# Altium schematic sheet Sheet_3.schdoc
size 300 x 214 mm
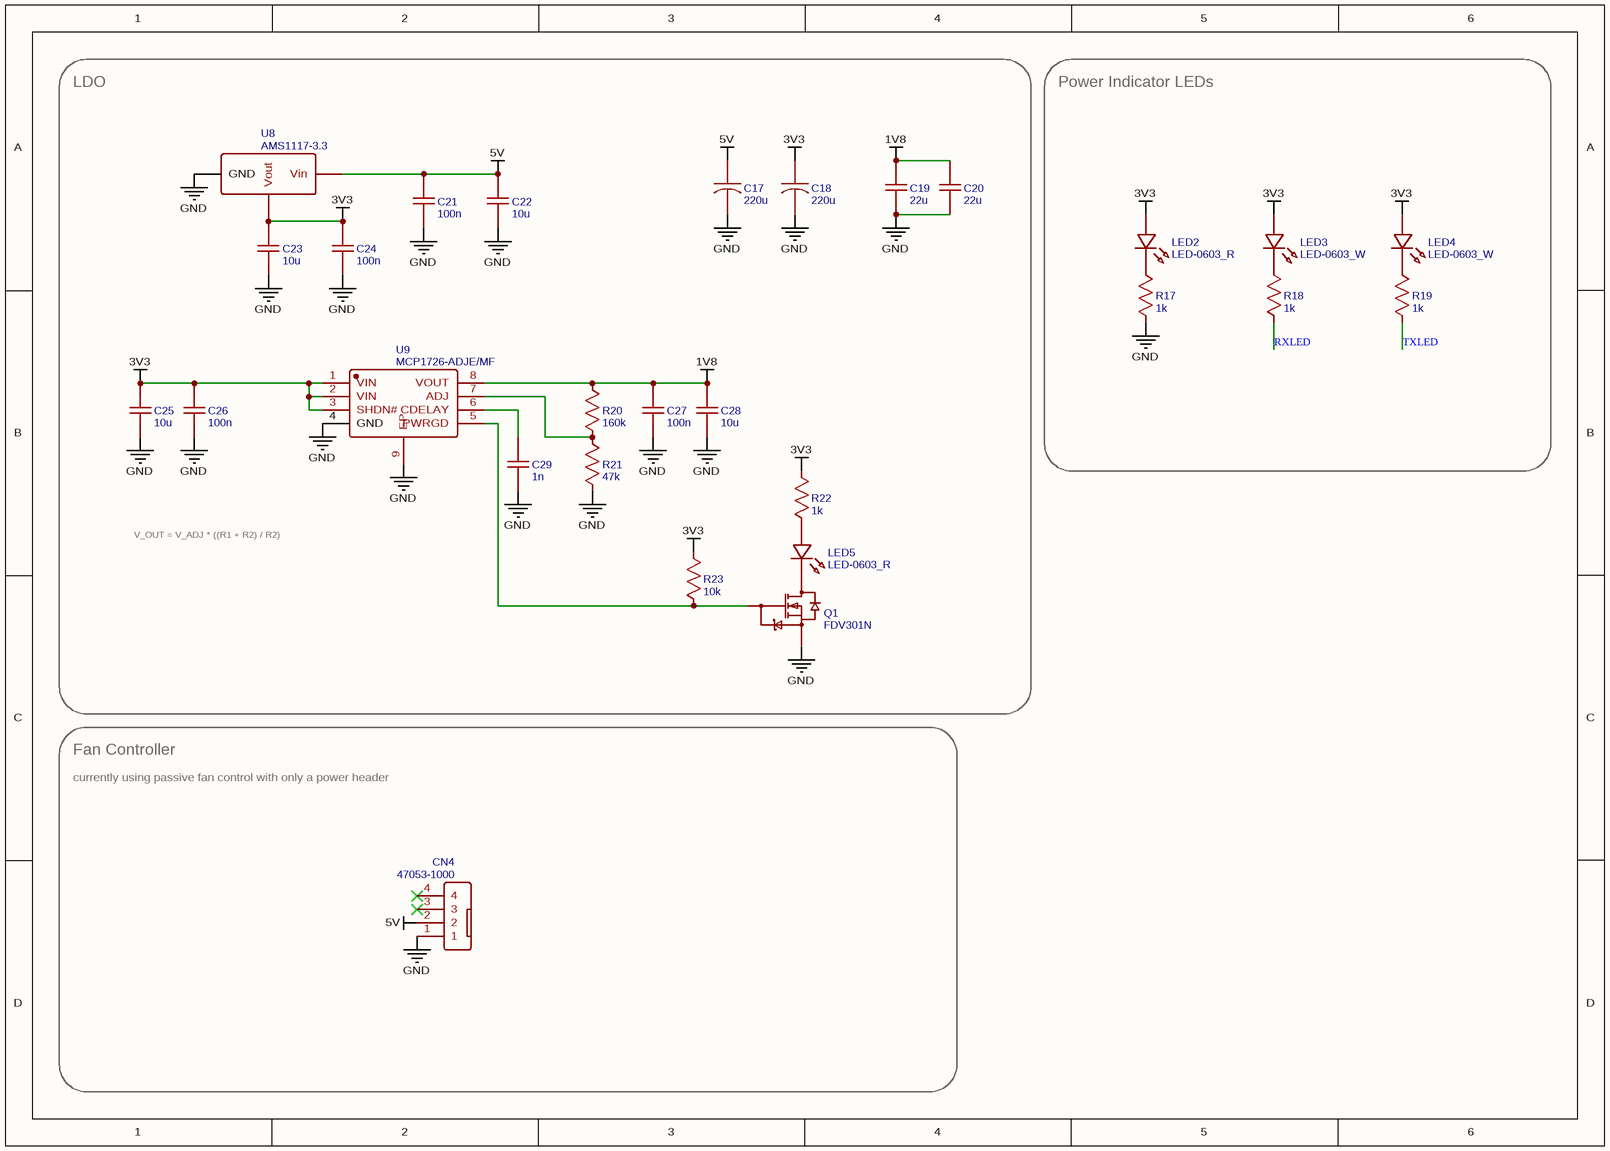
[diagram p0: Sheet_3.schdoc]

## Parts
C17  220u  [CAPPR5.0-D6.3_L6.6_W6.6]
C18  220u  [CAPPR5.0-D6.3_L6.6_W6.6]
C19  22u  [CAPA-1206]
C20  22u  [CAPA-1206]
C21  100n  [CAPA-0402]
C22  10u  [CAPA-0402]
C23  10u  [CAPA-0402]
C24  100n  [CAPA-0402]
C25  10u  [CAPA-0402]
C26  100n  [CAPA-0402]
C27  100n  [CAPA-0402]
C28  10u  [CAPA-0402]
C29  1n  [CAPA-0402]
CN4  47053-1000  [CONN-TH_47053-1000]
LED2  LED-0603_R  [LED-0603]
LED3  LED-0603_W  [LED-0603]
LED4  LED-0603_W  [LED-0603]
LED5  LED-0603_R  [LED-0603]
Q1  FDV301N  [SOT-23_L2.9-W1.3-P1.90-LS2.4-BR]
R17  1k  [RES-0402]
R18  1k  [RES-0402]
R19  1k  [RES-0402]
R20  160k  [RES-0402]
R21  47k  [RES-0402]
R22  1k  [RES-0402]
R23  10k  [RES-0402]
U8  AMS1117-3.3  [SOT-223_L6.5_W3.5_P2.30_BL]
U9  MCP1726-ADJE/MF  [TDFN-8_L3.0-W3.0-P0.65-BL-EP]

## Blocks framed on the sheet
LDO: C17-C29 LED5 Q1 R20-R23 U8 U9
Power Indicator LEDs: LED2-LED4 R17-R19
Fan Controller: CN4

## Nets
1V8: C19.2 C20.2 C27.2 C28.2 R20.2 U9.8(VOUT)
3V3: C18.1 C23.2 C24.2 C25.2 C26.2 LED2.1 LED3.1 LED4.1 R22.2 R23.2 U8.2(Vout) U9.1(VIN) U9.2(VIN) U9.3(SHDN#)
5V: C17.1 C21.2 C22.2 CN4.2 U8.3(Vin)
GND: C17.2 C18.2 C19.1 C20.1 C21.1 C22.1 C23.1 C24.1 C25.1 C26.1 C27.1 C28.1 C29.1 CN4.1 Q1.2(S) R17.1 R21.1 U8.1(GND) U9.4(GND) U9.9(EP)
RXLED: R18.1
TXLED: R19.1
NetC29_2: C29.2 U9.6(CDELAY)
NetLED2_2: LED2.2 R17.2
NetLED3_2: LED3.2 R18.2
NetLED4_2: LED4.2 R19.2
NetLED5_1: LED5.1 R22.1
NetLED5_2: LED5.2 Q1.3(D)
NetQ1_1: Q1.1(G) R23.1 U9.5(PWRGD)
NetR20_1: R20.1 R21.2 U9.7(ADJ)

Not connected (* = marked no-connect by the designer): CN4 3* 4*

## Notes on the sheet
- V_OUT = V_ADJ * ((R1 + R2) / R2)
- currently using passive fan control with only a power header

## Library data of the parts
C17 C18 = 220u: BOM_Manufacturer Part: CK1A221M-CRE54; BOM_Manufacturer: SEMTECH 先科; nameAlias: Value(F); BOM_Supplier Part: C131157; BOM_Supplier: LCSC; link: https://atta.szlcsc.com//upload/public/pdf/source/20170919/C131157_1505787258263977000.pdf; spicePre: C; spiceSymbolName: CAPPR5.0-D6.3_220u_10V
C19 C20 = 22u: BOM_Manufacturer Part: CL31A226KAHNNNE; BOM_Manufacturer: SAMSUNG; nameAlias: Value(F); BOM_Supplier Part: C12891; BOM_Supplier: LCSC; link: https://atta.szlcsc.com/upload/public/pdf/source/20170325/1490427913016.pdf; spicePre: C; spiceSymbolName: CAPA-1206_22u_25V
C21 C24 C26 C27 = 100n: BOM_Manufacturer Part: CL05B104KB54PNC; BOM_Manufacturer: SAMSUNG; nameAlias: Value(F); BOM_Supplier Part: C307331; BOM_Supplier: LCSC; link: https://atta.szlcsc.com//upload/public/pdf/source/20160103/1457707735223.pdf; spicePre: C; spiceSymbolName: CAPA-0402_100n
C22 C23 C25 C28 = 10u: BOM_Manufacturer Part: JMK105CBJ106MV-F; BOM_Manufacturer: TAIYO YUDEN; nameAlias: Value(F); BOM_Supplier Part: C87148; BOM_Supplier: LCSC; link: https://atta.szlcsc.com//upload/public/pdf/source/20161110/1478747663421.pdf; spicePre: C; spiceSymbolName: CAPA-0402_10u
C29 = 1n: BOM_Manufacturer Part: CC0402JRNPO9BN102; BOM_Manufacturer: YAGEO 国巨; nameAlias: Value(F); BOM_Supplier Part: C113780; BOM_Supplier: LCSC; link: https://atta.szlcsc.com//upload/public/pdf/source/20170602/1496384427106.pdf; spicePre: C; spiceSymbolName: CAPA-0402_1n
CN4 = 47053-1000: BOM_Manufacturer: MOLEX; BOM_Manufacturer Part: 470531000; BOM_Supplier: LCSC; BOM_Supplier Part: C240840; BOM_JLCPCB Part Class: Extended Part; spicePre: C; spiceSymbolName: 47053-1000
LED2 LED5 = LED-0603_R: BOM_Manufacturer: EVERLIGHT 台湾亿光; BOM_Manufacturer Part: 19-217/R6C-AL1M2VY/3T; Contributor: LCEDA_01; BOM_Supplier Part: C72044; BOM_Supplier: LCSC; link: https://atta.szlcsc.com//upload/public/pdf/source/20160507/1462613613821.pdf; spicePre: L; spiceSymbolName: LED-0603_R
LED3 LED4 = LED-0603_W: BOM_Manufacturer: KENTO; BOM_Manufacturer Part: LED White; BOM_Supplier Part: C2290; BOM_Supplier: LCSC; link: https://atta.szlcsc.com//upload/public/pdf/source/20160507/1462613613821.pdf; spicePre: L; spiceSymbolName: LED-0603_W
Q1 = FDV301N: BOM_Manufacturer: onsemi(安森美); BOM_Supplier: LCSC; BOM_Manufacturer Part: FDV301N; BOM_Supplier Part: C15310; BOM_JLCPCB Part Class: Extended Part; spicePre: Q; spiceSymbolName: FDV301N
R17-R19 R22 = 1k: BOM_Manufacturer Part: 0402WGF1001TCE; BOM_Manufacturer: UniOhm 台湾厚声; nameAlias: Value(Ω); BOM_Supplier Part: C11702; BOM_Supplier: LCSC; link: https://atta.szlcsc.com//upload/public/pdf/source/20200306/C422600_1E6D84923E4A46A82E41ADD87F860B5C.pdf; spicePre: R; spiceSymbolName: RES-0402_1k
R20 = 160k: BOM_Manufacturer Part: 0402WGF1603TCE; BOM_Manufacturer: UniOhm 台湾厚声; nameAlias: Value(Ω); BOM_Supplier Part: C25757; BOM_Supplier: LCSC; link: https://atta.szlcsc.com//upload/public/pdf/source/20200306/C422600_1E6D84923E4A46A82E41ADD87F860B5C.pdf; spicePre: R; spiceSymbolName: RES-0402_160k
R21 = 47k: BOM_Manufacturer Part: 0402WGF4702TCE; BOM_Manufacturer: UniOhm 台湾厚声; nameAlias: Value(Ω); BOM_Supplier Part: C25792; BOM_Supplier: LCSC; link: https://atta.szlcsc.com//upload/public/pdf/source/20200306/C422600_1E6D84923E4A46A82E41ADD87F860B5C.pdf; spicePre: R; spiceSymbolName: RES-0402_47k
R23 = 10k: BOM_Manufacturer Part: 0402WGF1002TCE; BOM_Manufacturer: UniOhm 台湾厚声; nameAlias: Value(Ω); BOM_Supplier Part: C25744; BOM_Supplier: LCSC; link: https://atta.szlcsc.com//upload/public/pdf/source/20200306/C422600_1E6D84923E4A46A82E41ADD87F860B5C.pdf; spicePre: R; spiceSymbolName: RES-0402_10k
U8 = AMS1117-3.3: BOM_Manufacturer: Advanced Monolithic Systems; Contributor: T-K-233; BOM_Manufacturer Part: AMS1117-3.3; BOM_Supplier: LCSC; BOM_Supplier Part: C6186; link: http://www.advanced-monolithic.com/pdf/ds1117.pdf; spicePre: U; spiceSymbolName: AMS1117-3.3
U9 = MCP1726-ADJE/MF: BOM_Manufacturer: MICROCHIP(美国微芯); BOM_Supplier: LCSC; BOM_Supplier Part: C184287; BOM_Manufacturer Part: MCP1726-ADJE/MF; BOM_JLCPCB Part Class: Extended Part; link: https://ww1.microchip.com/downloads/aemDocuments/documents/APID/ProductDocuments/DataSheets/1A-Low-Voltage-Low-Quiescent-Current-LDO-Regulator-DS20001936E.pdf; spicePre: U; spiceSymbolName: MCP1726-ADJE/MF